# EAGLE schematic schema sensors (EAGLE 9.6.0)
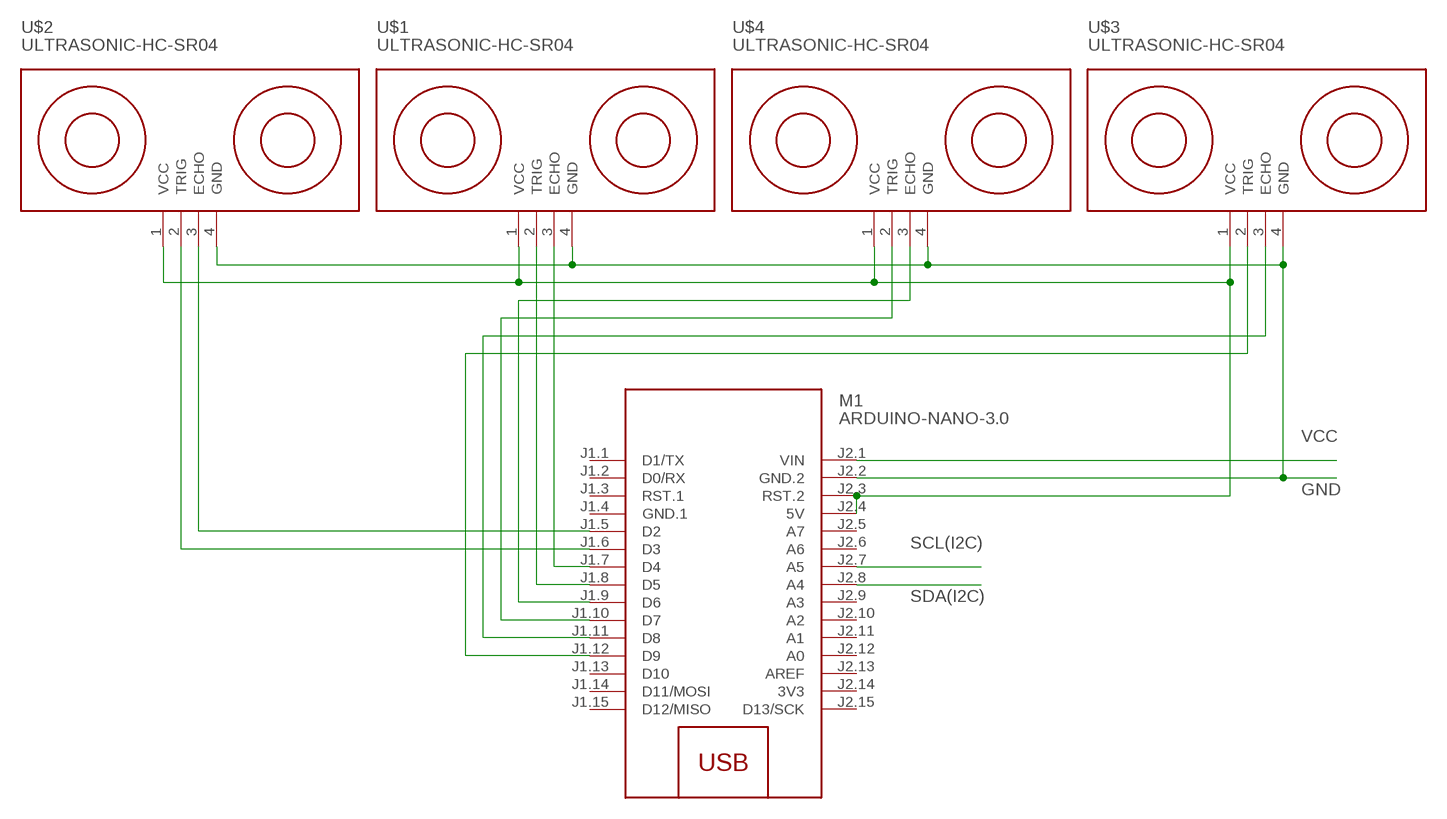
[diagram p0: schematic, sheet 1]

## Parts
M1  ARDUINO-NANO-3.0  [ARDUINO-NANO-3.0]
U$1  ULTRASONIC-HC-SR04  [ULTRASONIC-HC-SR04]
U$2  ULTRASONIC-HC-SR04  [ULTRASONIC-HC-SR04]
U$3  ULTRASONIC-HC-SR04  [ULTRASONIC-HC-SR04]
U$4  ULTRASONIC-HC-SR04  [ULTRASONIC-HC-SR04]

## Nets
GND: M1.J2.2(GND.2) U$1.4(GND) U$2.4(GND) U$3.4(GND) U$4.4(GND)
N$2: M1.J1.9(D6) U$4.3(ECHO)
N$3: M1.J1.10(D7) U$4.2(TRIG)
N$4: M1.J1.11(D8) U$3.3(ECHO)
N$5: M1.J2.3(RST.2) M1.J2.4(5V) U$1.1(VCC) U$2.1(VCC) U$3.1(VCC) U$4.1(VCC)
N$6: M1.J1.12(D9) U$3.2(TRIG)
N$9: M1.J1.5(D2) U$2.3(ECHO)
N$10: M1.J1.6(D3) U$2.2(TRIG)
N$11: M1.J1.7(D4) U$1.3(ECHO)
N$12: M1.J1.8(D5) U$1.2(TRIG)
SCL(I2C): M1.J2.7(A5)
SDA(I2C): M1.J2.8(A4)
VCC: M1.J2.1(VIN)
Unconnected: M1.J1.1(D1/TX) M1.J1.2(D0/RX) M1.J1.3(RST.1) M1.J1.13(D10) M1.J1.14(D11/MOSI) M1.J1.15(D12/MISO) M1.J2.5(A7) M1.J2.6(A6) M1.J2.9(A3) M1.J2.10(A2) M1.J2.11(A1) M1.J2.12(A0) M1.J2.13(AREF) M1.J2.15(D13/SCK)

## Power pins joined to a net without a drawn wire
3V3: M1.J2.14(3V3)
GND.1: M1.J1.4(GND.1)

## Library data of the parts
M1 = diy-modules:ARDUINO-NANO-3.0: Arduino Nano 3.0 and compatible devices More details available here: https://www.arduino.cc/en/Main/ArduinoBoardNano Click here to find device on ebay.com <http://www.ebay.com/sch/arduino+nano>
U$1-U$4 = diy-modules:ULTRASONIC-HC-SR04: Ultrasonic Ranging Module HC-SR04 More details available here: http://randomnerdtutorials.com/complete-guide-for-ultrasonic-sensor-hc-sr04/ Click here to find device on ebay.com <http://www.ebay.com/sch/hc+sr04+ultrasonic>